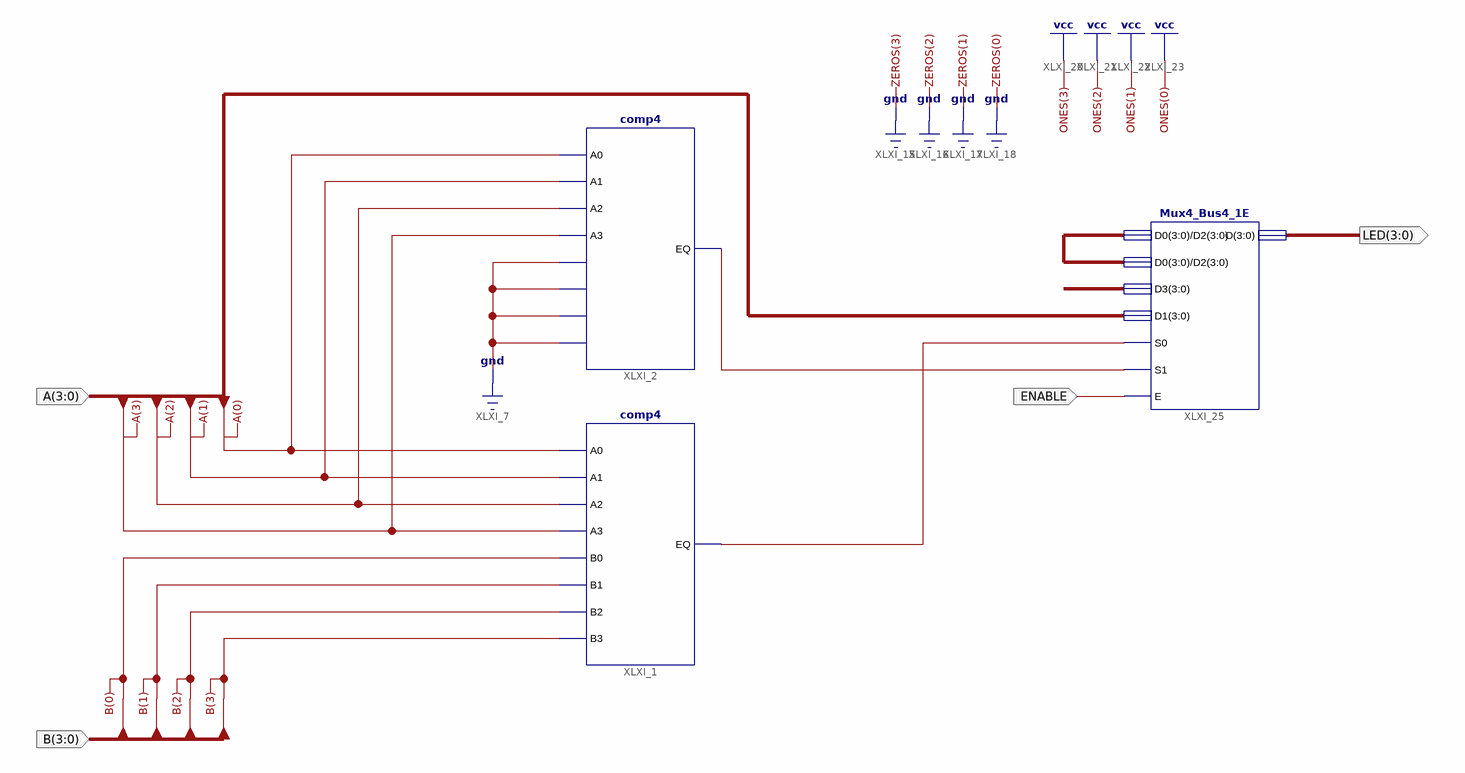
[diagram p0: schematic sheet 1]
// Xilinx ISE schematic LEDsDriver.sch (spartan6) as structural Verilog: 3 symbols, 4 ports
module LEDsDriver (
  input  [3:0] A,
  input  [3:0] B,
  input  ENABLE,
  output [3:0] LED
);

  wire XLXN_58, XLXN_61;

  comp4 XLXI_1 (.A0(A[0]), .A1(A[1]), .A2(A[2]), .A3(A[3]), .B0(B[0]), .B1(B[1]), .B2(B[2]), .B3(B[3]), .EQ(XLXN_61));
  comp4 XLXI_2 (.A0(A[0]), .A1(A[1]), .A2(A[2]), .A3(A[3]), .B0(1'b0), .B1(1'b0), .B2(1'b0), .B3(1'b0), .EQ(XLXN_58));
  Mux4_Bus4_1E XLXI_25 (
    .D0(4'b0000), .D2(4'b0000), .D3(4'b1111), .D1(A), .S0(XLXN_61), .S1(XLXN_58), .E(ENABLE), .O(LED));
endmodule
